# EAGLE design twilight-photometer-1 (EAGLE 9.6.2)
DESIGNER: Dan Bowen
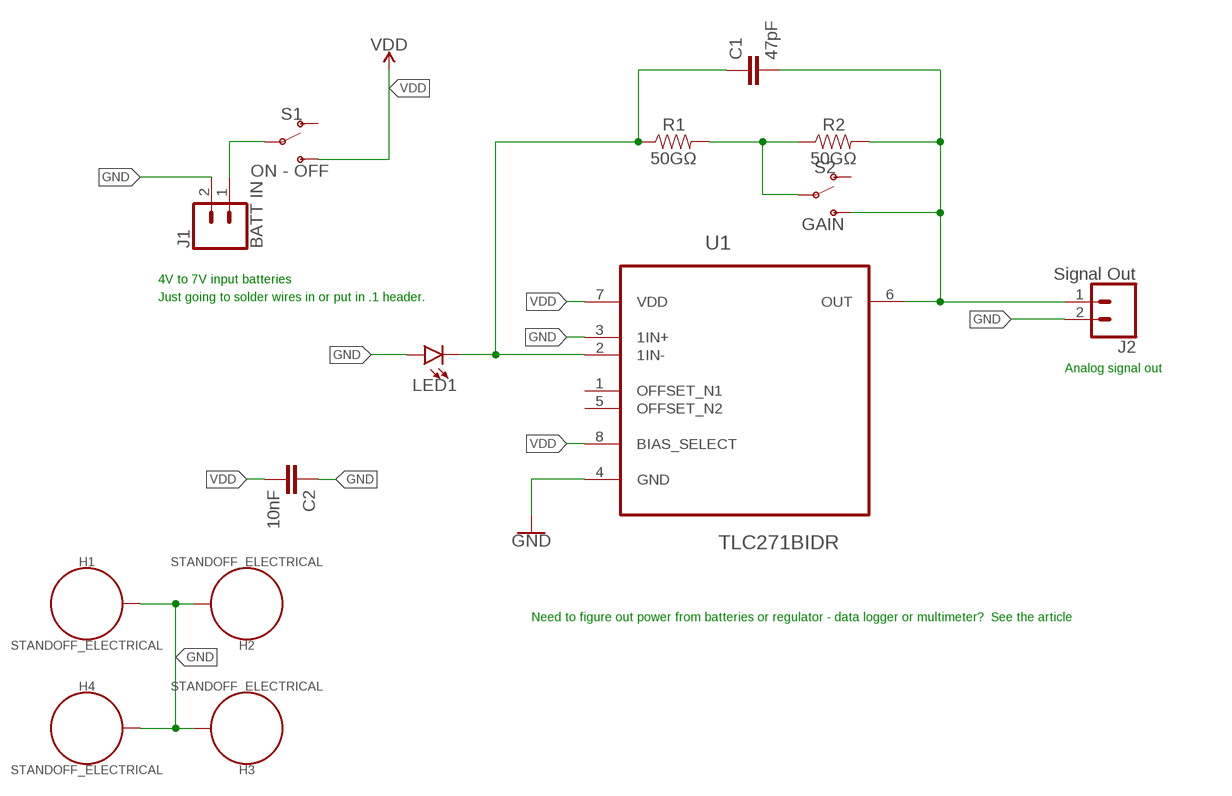
[diagram p0: schematic, sheet 1]

## Parts
C1  47pF  47PF-0603-50V-5%  [0603]
C2  10nF  10NF-0603-50V-10%  [0603]
H1  STANDOFF_ELECTRICAL  [STANDOFF-ELECTRICAL]
H2  STANDOFF_ELECTRICAL  [STANDOFF-ELECTRICAL]
H3  STANDOFF_ELECTRICAL  [STANDOFF-ELECTRICAL]
H4  STANDOFF_ELECTRICAL  [STANDOFF-ELECTRICAL]
J1  BATT IN  CONN_02LOCK_LONGPADS  [1X02_LOCK_LONGPADS]
J2  Signal Out  CONN_02LOCK_LONGPADS  [1X02_LOCK_LONGPADS]
LED1  LED5MM  [LED_5MM]
R1  50GΩ  RESISTOR0805  [0805]
R2  50GΩ  RESISTOR0805  [0805]
S1  ON - OFF  SWITCH-SPDT-PTH-11.6X4.0MM-LOCK  [SWITCH_SPDT_PTH_11.6X4.0MM_LOCK]
S2  GAIN  SWITCH-SPDT-PTH-11.6X4.0MM-LOCK  [SWITCH_SPDT_PTH_11.6X4.0MM_LOCK]
U1  TLC271BIDR  TLC271ACD  [SOIC127P600X175-8N]

## Nets
GND: C2.1 H1.P1 H2.P1 H3.P1 H4.P1 J1.2 J2.2 LED1.A U1.3(1IN+) U1.4(GND)
N$1: R1.2 R2.1 S2.2(P)
N$2: C1.1 LED1.K(C) R1.1 U1.2(1IN-)
N$3: J1.1 S1.2(P)
N$5: C1.2 J2.1 R2.2 S2.3(S) U1.6(OUT)
VDD: C2.2 S1.3(S) U1.7(VDD) U1.8(BIAS_SELECT)
Unconnected: S1.1(O) S2.1(O) U1.1(OFFSET_N1) U1.5(OFFSET_N2)

## Notes on the sheet
- 4V to 7V input batteries
- Just going to solder wires in or put in .1 header.
- Analog signal out
- Need to figure out power from batteries or regulator - data logger or multimeter?  See the article

## Library data of the parts
C1 = SparkFun-Capacitors:47PF: 47pF ceramic capacitors A capacitor is a passive two-terminal electrical component used to store electrical energy temporarily in an electric field.; PROD_ID: CAP-08913
C2 = SparkFun-Capacitors:10NF: 0.01uF/10nF/10,000pF ceramic capacitors A capacitor is a passive two-terminal electrical component used to store electrical energy temporarily in an electric field. CAP-09321; PROD_ID: CAP-00867
H1-H4 = SparkFun-Hardware:STANDOFF_ELECTRICAL: Stand Off Drill holes with an electrical connection. For example, use these to ground your board to a chassis. Example SparkFun Products Screw - Phillips Head (1/4", 4-40, 10 pack) <https://www.sparkfun.com/products/10453> (PRT-10453) Screw - Phillips Head (1/2", 4-40, 10 pack) <https://www.sparkfun.com/products/10452> (PRT-10452) Screw - Phillips Head (3/4", 4-40, 10 pack) <https://www.sparkfun.com/products/10451> (PRT-10451) Screw - Phillips Head (1", 4-40, 10 pack) <https://www.sparkfun.com/products/10450> (PRT-10450)
J1 J2 = SparkFun-Connectors:CONN_02: Multi connection point. Often used as Generic Header-pin footprint for 0.1 inch spaced/style header connections On any of the 0.1 inch spaced packages, you can populate with these: Break Away Headers - Straight <https://www.sparkfun.com/products/116> (PRT-00116) Break Away Male Headers - Right Angle <https://www.sparkfun.com/products/553> (PRT-00553) Female Headers <https://www.sparkfun.com/products/115> (PRT-00115) Break Away Headers - Machine Pin <https://www.sparkfun.com/products/117> (PRT-00117) Break Away Female Headers - Swiss Machine Pin <https://www.sparkfun.com/products/743> (PRT-00743) For SCREWTERMINALS and SPRING TERMINALS visit here: Screw Terimnals on SparkFun.com <https://www.sparkfun.com/search/results?term=Screw+Terminals> (5mm/3.5mm/2.54mm spacing) This device is also useful as a general connection point to wire up your design to another part of your project. Our various solder wires solder well into these plated through hole pads. Hook-Up Wire - Assortment (Stranded, 22 AWG) <https://www.sparkfun.com/products/11375> (PRT-11375) Hook-Up Wire - Assortment (Solid Core, 22 AWG) <https://www.sparkfun.com/products/11367> (PRT-11367) View the entire wire category on our website here <https://www.sparkfun.com/categories/141> Special notes: Molex polarized connector foot print use with: PRT-08233 with associated crimp pins and housings. 2.54_SCREWTERM for use with PRT-10571. 3.5mm Screw Terminal footprints for PRT-08084 5mm Screw Terminal footprints for use with PRT-08432
LED1 = SparkFun-LED:LED: LED (Generic) Standard schematic elements and footprints for 5mm, 3mm, 1206, and 0603 sized LEDs. Generic LEDs with no color specified.
R1 R2 = SparkFun-Resistors:RESISTOR: Generic Resistor Package
S1 S2 = SparkFun-Switches:SWITCH-SPDT: Single Pole, Double Throw (SPDT) Switch Single-pole, double-throw (SPDT) switch. Variant Overview SMD-AYZ0202 Surface Mount DPDT Switch <https://www.sparkfun.com/products/597> (COM-00597) Used on e.g. LilyPad Arduino USB - ATmega32U4 Board <https://www.sparkfun.com/products/12049> PTH-11.6X4.0MM SPDT Mini Power Switch <https://www.sparkfun.com/products/102> (COM-00102) Used on e.g. SparkFun Simon Says - Through-Hole Soldering Kit <https://www.sparkfun.com/products/10547> (KIT-10547) PTH-11.6X4.0MM-KIT KIT version of SPDT Mini Power Switch - Simplifies soldering by removing tStop of switch pins - only one side can be soldered. PTH-11.6X4.0MM-LOCK LOCK version of SPDT Mini Power Switch - Offset pins hold switch in place for easier soldering. SMD-RIGHT-ANGLE Surface Mount Right Angle Switch <https://www.sparkfun.com/products/10860> (COM-10860) Used on e.g. SparkFun ESP8266 Thing <https://www.sparkfun.com/products/13231>; PROD_ID: SWCH-08261; SF_SKU: COM-00102
U1 = Texas Instruments_By_element14_Batch_1:TLC271ACD: LinCMOS. PROGRAMMABLE LOW-POWER OPERATIONAL AMPLIFIERS; MPN: TLC271ACD; OC_FARNELL: 2386707; OC_NEWARK: 08F9076; PACKAGE: SOIC-8; SUPPLIER: Texas Instruments

## Board
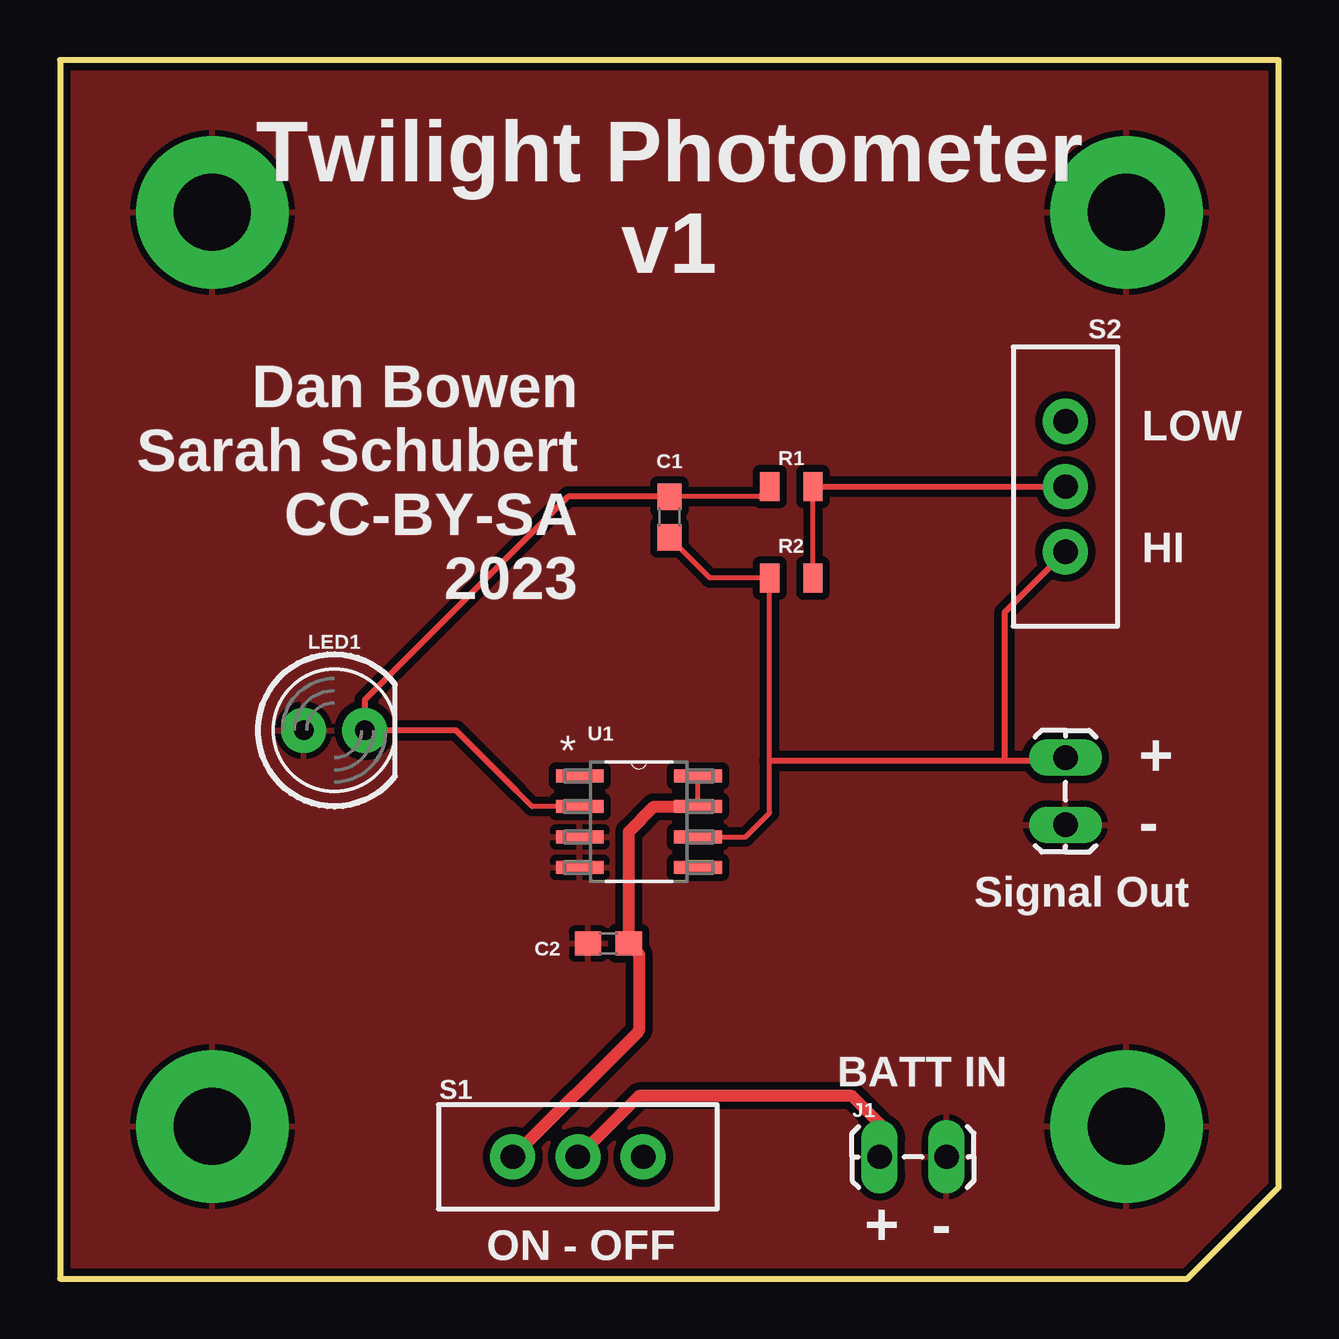
[diagram p1: board, top side]
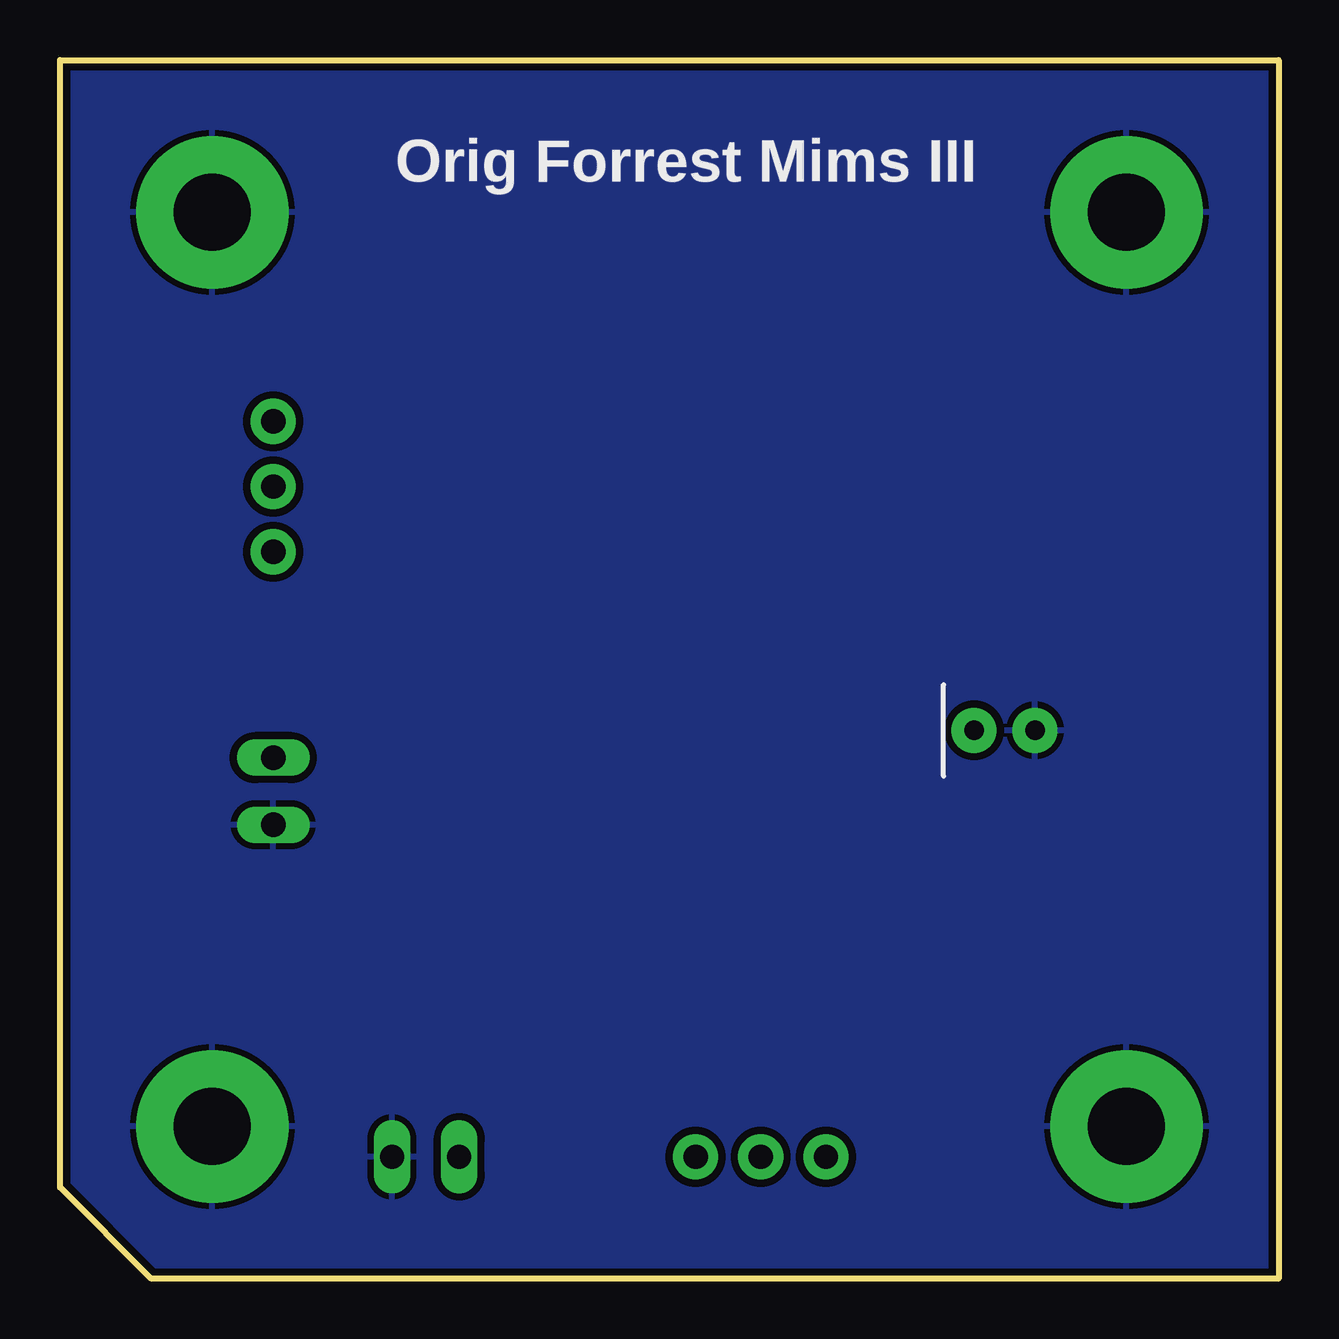
[diagram p2: board, bottom side, seen from below]

Size 50.8 x 50.8 mm. Coordinates in mm from the lower left corner, seen from the top.
Outline: 0,0 46.99,0 50.8,3.81 50.8,50.8 0,50.8 0,0
Copper layers (1*16): Top 0.035mm / dielectric 1.5mm / Bottom 0.035mm
Design rules "SparkFun-2-Layer-General-JLCPCB": minimum track width 7mil, minimum drill 0.3mm, track to track 7mil, track to pad 7mil, pad to pad 7mil, via to via 7mil, smd to smd 7mil, copper to edge 7mil, drill to drill 7mil, minimum pad ring 7mil, minimum via ring 7mil, stop-mask expansion 3mil, vias tented up to drill 25mil, thermal gap 10mil

### Footprints (pad centres in the part's own frame; a part is rotated, then mirrored left to right if it is on the bottom)
0603 = smd 1.1 x 1: 1 -0.85,0; 2 0.85,0
STANDOFF-ELECTRICAL = drill 3.2 pad 6.35: P1 0,0
1X02_LOCK_LONGPADS = drill 1.016 long: 1 -0.127,0; 2 2.667,0
LED_5MM = drill 0.813 pad 1.88: A -1.27,0; K 1.27,0
0805 = smd 0.8 x 1.2: 1 -0.9,0; 2 0.9,0
SWITCH_SPDT_PTH_11.6X4.0MM_LOCK = drill 1.016 pad 1.88: 1 0,2.718; 2 0,0; 3 0,-2.718
SOIC127P600X175-8N = smd 1.981 x 0.559: 1 -2.464,1.905; 2 -2.464,0.635; 3 -2.464,-0.635; 4 -2.464,-1.905; 5 2.464,-1.905; 6 2.464,-0.635; 7 2.464,0.635; 8 2.464,1.905

### Placement (x,y rotation side)
C1  25.4,31.75 270 top
C2  22.86,13.97 0 top
H1  6.35,44.45 0 top
H2  44.45,44.45 0 top
H3  44.45,6.35 0 top
H4  6.35,6.35 0 top
J1  34.29,5.08 0 top
J2  41.91,21.59 270 top
LED1  11.43,22.86 0 top
R1  30.48,33.02 0 top
R2  30.48,29.21 180 top
S1  21.59,5.08 270 top
S2  41.91,33.02 0 top
U1  24.13,19.05 0 top

### Tracks (layer width: path | path; a pad name or v marks a point on that pad's centre or on a via)
GND
  pour Top (isolate 0.305): 0,0 0,50.8 50.8,50.8 50.8,3.81 46.99,0
  pour Bottom (isolate 0.305): 0,0 0,50.8 50.8,50.8 50.8,3.81 46.99,0
N$1
  Top 0.203: R2.1 R1.2
  Top 0.254: R1.2 S2.2
N$2
  Top 0.203: R1.1 29.16,32.6 C1.1 | U1.2 19.68,19.68 19.05,20.32
  Top 0.254: C1.1 21.17,32.6 12.7,24.13 LED1.K 16.51,22.86 19.05,20.32
N$3
  Top 0.508: J1.1 34.16,6.48 33.02,7.62 24.13,7.62 S1.2
N$5
  Top 0.203: U1.6 28.57,18.41 29.58,19.42 29.58,21.59 R2.2 27.09,29.21 C1.2
  Top 0.254: J2.1 41.78,21.59 39.37,21.59 | 39.37,21.59 29.58,21.59 | S2.3 39.37,27.76 39.37,21.59
VDD
  Top 0.203: U1.7 U1.8
  Top 0.508: S1.3 24.13,10.34 24.13,13.55 C2.2 23.71,18.63 24.77,19.68 U1.7

### Text on the board
tPlace: Twilight Photometer / v1 | Dan Bowen / Sarah Schubert / CC-BY-SA / 2023 | LOW | HI | + | - | + | -
bPlace: Orig Forrest Mims III